# Altium schematic sheet TMS320C5509A.SchDoc
size 381 x 325 mm
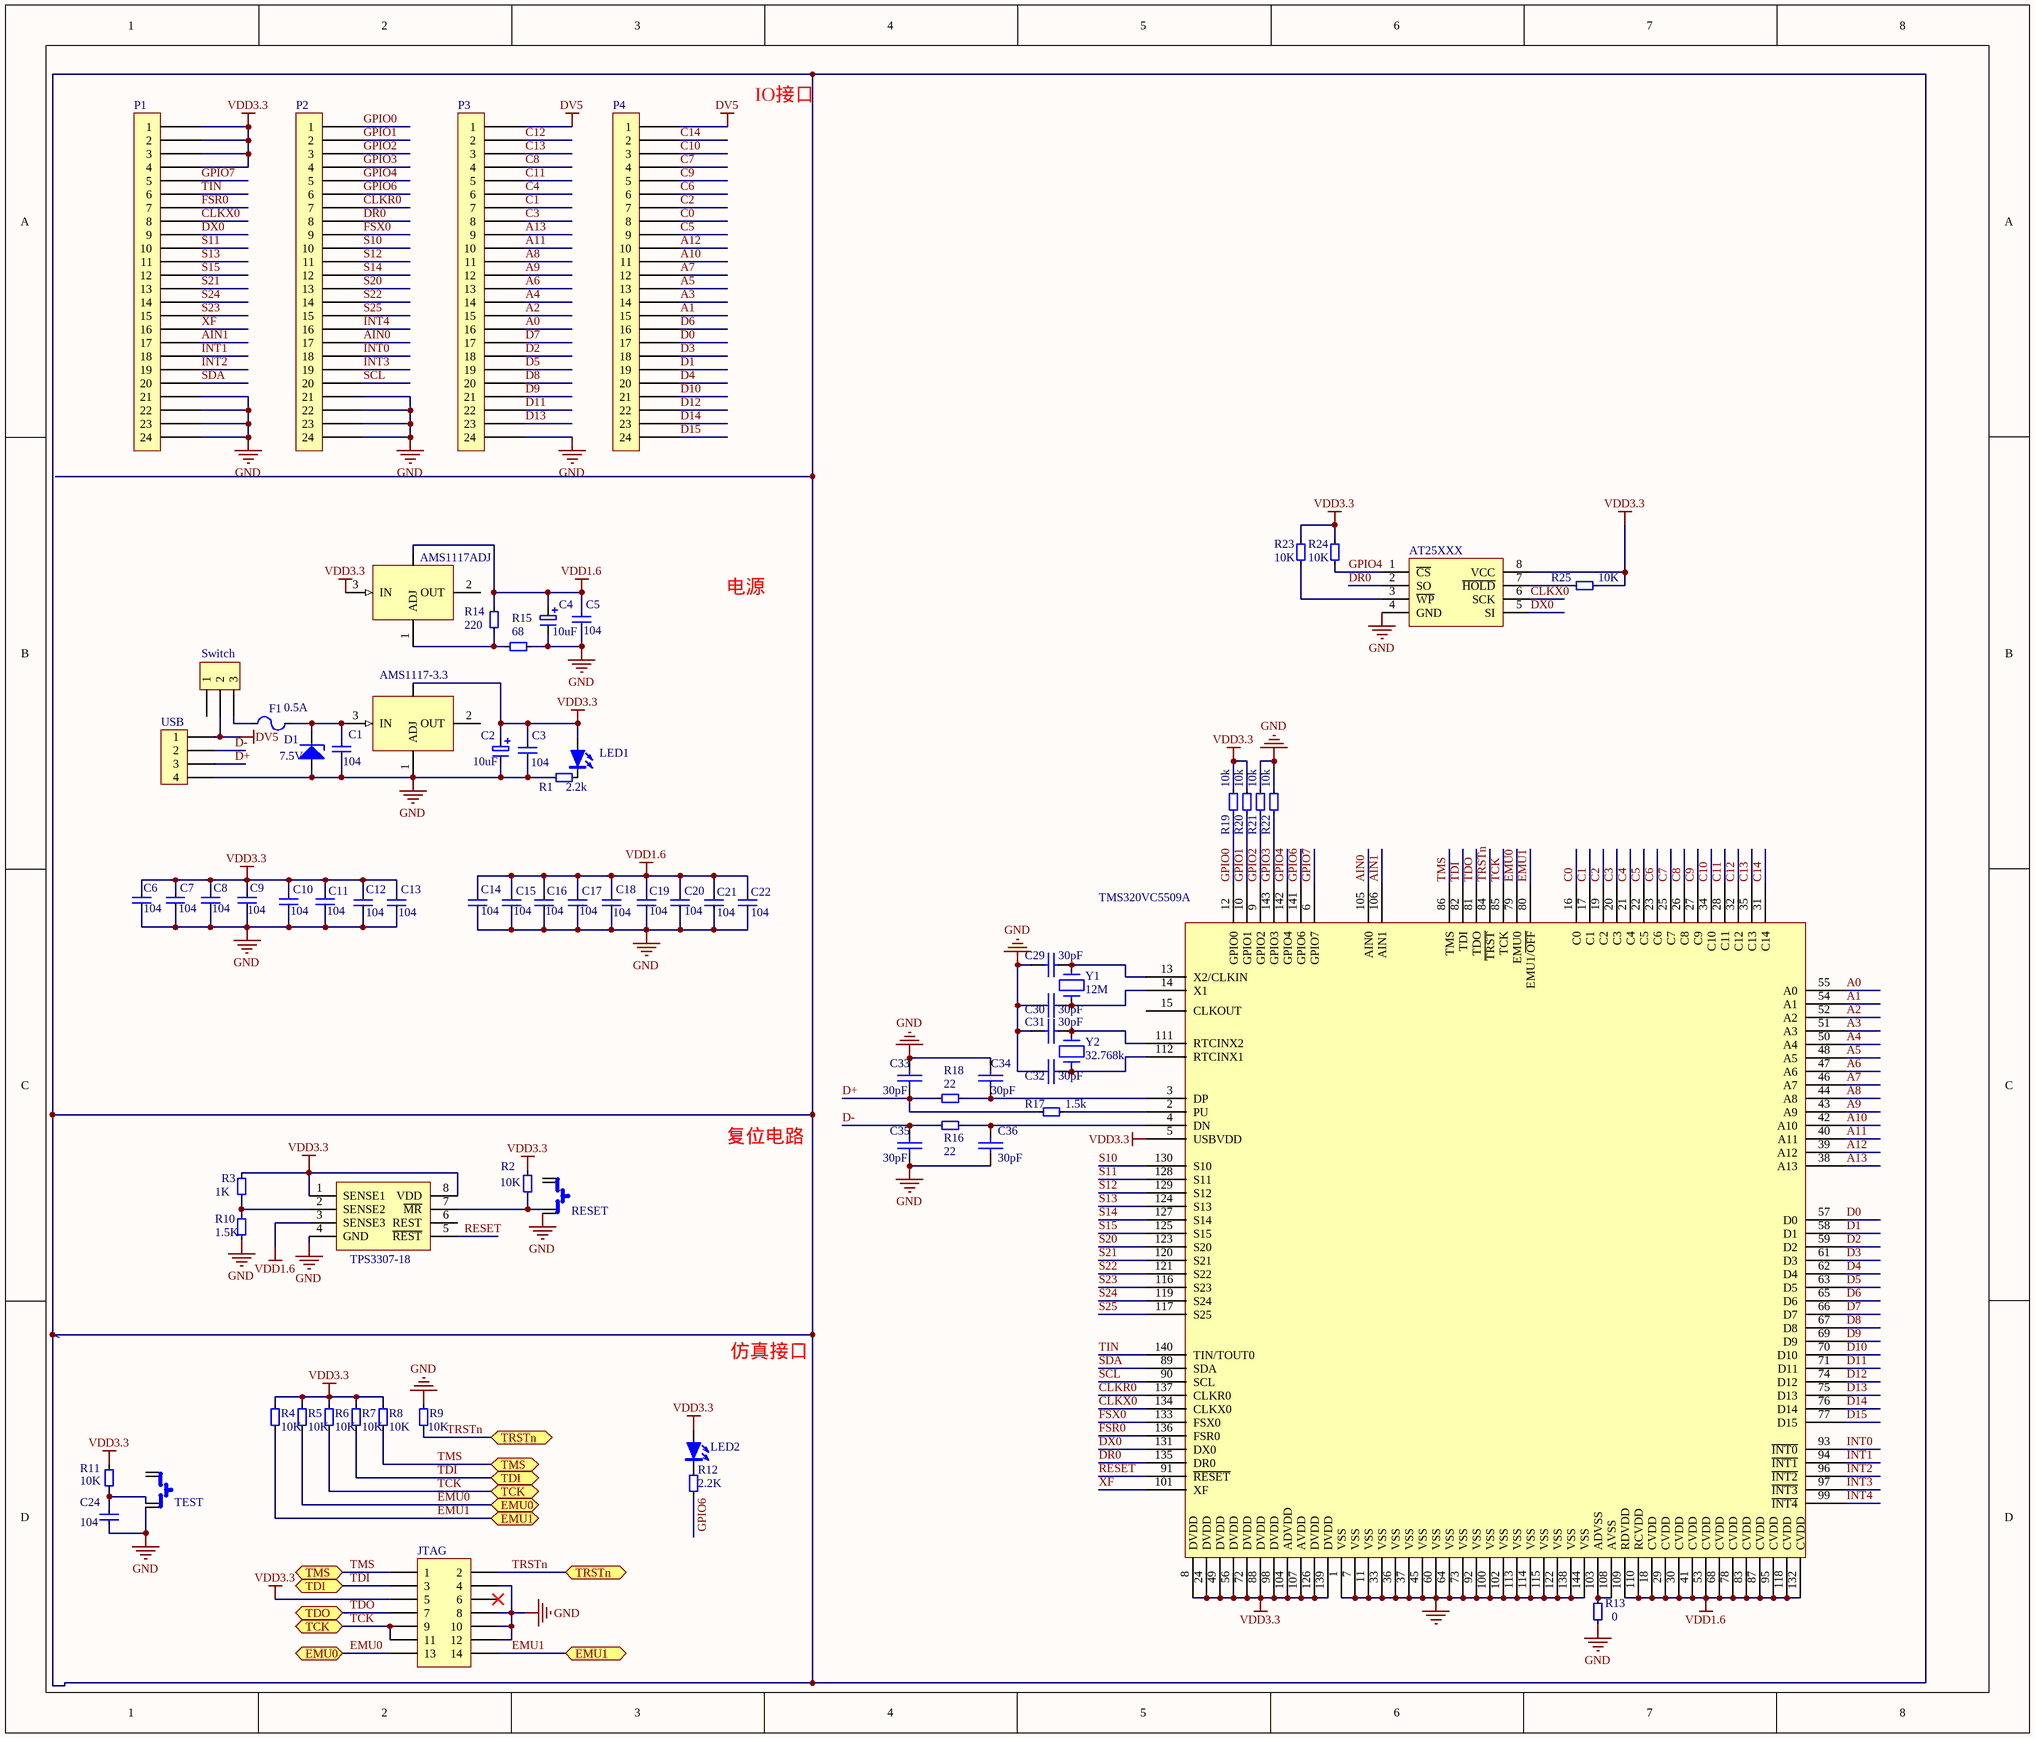
[diagram p0: TMS320C5509A.SchDoc]

## Parts
AMS1117-3.3  1117  [SOT-223]  (value not drawn)
AMS1117ADJ  1117  [SOT-223]  (value not drawn)
AT25XXX  (no value)
C1  104  [0805]
C2  10uF  [CE3528]
C3  104  [0805]
C4  10uF  [CE3528]
C5  104  [0805]
C6  104  [0805]
C7  104  [0805]
C8  104  [0805]
C9  104  [0805]
C10  104  [0805]
C11  104  [0805]
C12  104  [0805]
C13  104  [0805]
C14  104  [0805]
C15  104  [0805]
C16  104  [0805]
C17  104  [0805]
C18  104  [0805]
C19  104  [0805]
C20  104  [0805]
C21  104  [0805]
C22  104  [0805]
C24  104  [0805]
C29  30pF  [0805]
C30  30pF  [0805]
C31  30pF  [0805]
C32  30pF  [0805]
C33  30pF  [0805]
C34  30pF  [0805]
C35  30pF  [0805]
C36  30pF  [0805]
D1  7.5V  [1206]
F1  0.5A  [F4532]
JTAG  Header 7X2  [IDC14A]  (value not drawn)
LED1  LED2  [0805]  (value not drawn)
LED2  LED2  [0805]  (value not drawn)
P1  SIP24  [SIP24]  (value not drawn)
P2  SIP24  [SIP24]  (value not drawn)
P3  SIP24  [SIP24]  (value not drawn)
P4  SIP24  [SIP24]  (value not drawn)
R1  2.2k  [0805]
R2  10K  [0805]
R3  1K  [0805]
R4  10K  [0805]
R5  10K  [0805]
R6  10K  [0805]
R7  10K  [0805]
R8  10K  [0805]
R9  10K  [0805]
R10  1.5K  [0805]
R11  10K  [0805]
R12  2.2K  [0805]
R13  0  [0805]
R14  220  [0805]
R15  68  [0805]
R16  22  [0805]
R17  1.5k  [0805]
R18  22  [0805]
R19  10k  [0805]
R20  10k  [0805]
R21  10k  [0805]
R22  10k  [0805]
R23  10K  [0805]
R24  10K  [0805]
R25  10K  [0805]
RESET  KEY2  [KEY0.2']  (value not drawn)
Switch  CON3  [5脚船型开关]  (value not drawn)
TEST  KEY2  [KEY0.2']  (value not drawn)
TMS320VC5509A  TMS320VC5509A  [TMS320LV5410]  (value not drawn)
TPS3307-18  (no value)  [SOP8]
USB  CON4  [USB2]  (value not drawn)
Y1  12M  [CY1]
Y2  32.768k  [CY1]

## Ports
EMU0 (bidir), EMU1 (bidir), TCK (bidir), TDI (bidir), TDO, TMS (bidir), TRSTn (bidir)

## Nets
DV5: P3.1 P4.1 Switch.2 USB.1
GND: AMS1117-3.3.1(ADJ) AT25XXX.4(GND) C1.2 C2.2 C3.2 C4.2 C5.2 C6.2 C7.2 C8.2 C9.2 C10.2 C11.2 C12.2 C13.2 C14.2 C15.2 C16.2 C17.2 C18.2 C19.2 C20.2 C21.1 C22.1 C24.1 C29.1 C30.1 C31.1 C32.1 C33.1 C34.2 C35.1 C36.2 D1.1 JTAG.4 JTAG.8 JTAG.10 JTAG.12 P1.21 P1.22 P1.23 P1.24 P2.21 P2.22 P2.23 P2.24 P3.24 R1.2 R9.2 R10.2 R13.1 R15.2 R21.1 R22.1 RESET.3 TEST.3 TMS320VC5509A.1(VSS) TMS320VC5509A.7(VSS) TMS320VC5509A.11(VSS) TMS320VC5509A.33(VSS) TMS320VC5509A.36(VSS) TMS320VC5509A.37(VSS) TMS320VC5509A.45(VSS) TMS320VC5509A.60(VSS) TMS320VC5509A.64(VSS) TMS320VC5509A.73(VSS) TMS320VC5509A.92(VSS) TMS320VC5509A.100(VSS) TMS320VC5509A.102(VSS) TMS320VC5509A.113(VSS) TMS320VC5509A.114(VSS) TMS320VC5509A.115(VSS) TMS320VC5509A.122(VSS) TMS320VC5509A.138(VSS) TMS320VC5509A.144(VSS) TPS3307-18.4(GND) USB.4
VDD1.6: AMS1117ADJ.4 C4.1 C5.1 C14.1 C15.1 C16.1 C17.1 C18.1 C19.1 C20.1 C21.2 C22.2 R14.1 TMS320VC5509A.18(CVDD) TMS320VC5509A.29(CVDD) TMS320VC5509A.30(CVDD) TMS320VC5509A.41(CVDD) TMS320VC5509A.53(CVDD) TMS320VC5509A.68(CVDD) TMS320VC5509A.78(CVDD) TMS320VC5509A.83(CVDD) TMS320VC5509A.87(CVDD) TMS320VC5509A.95(CVDD) TMS320VC5509A.109(RDVDD) TMS320VC5509A.110(RCVDD) TMS320VC5509A.118(CVDD) TMS320VC5509A.132(CVDD) TPS3307-18.3(SENSE3)
VDD3.3: AMS1117-3.3.4 AMS1117ADJ.3(IN) AT25XXX.8(VCC) C2.1 C3.1 C6.1 C7.1 C8.1 C9.1 C10.1 C11.1 C12.1 C13.1 JTAG.5 LED1.1 LED2.1 P1.1 P1.2 P1.3 P1.4 R2.1 R3.2 R4.2 R5.2 R6.2 R7.2 R8.2 R11.1 R19.1 R20.1 R23.1 R24.2 R25.1 TMS320VC5509A.5(USBVDD) TMS320VC5509A.8(DVDD) TMS320VC5509A.24(DVDD) TMS320VC5509A.49(DVDD) TMS320VC5509A.56(DVDD) TMS320VC5509A.72(DVDD) TMS320VC5509A.88(DVDD) TMS320VC5509A.98(DVDD) TMS320VC5509A.104(ADVDD) TMS320VC5509A.107(AVDD) TMS320VC5509A.126(DVDD) TMS320VC5509A.139(DVDD) TPS3307-18.1(SENSE1) TPS3307-18.8(VDD)
A0: P3.16 TMS320VC5509A.55(A0)
A1: P4.15 TMS320VC5509A.54(A1)
A2: P3.15 TMS320VC5509A.52(A2)
A3: P4.14 TMS320VC5509A.51(A3)
A4: P3.14 TMS320VC5509A.50(A4)
A5: P4.13 TMS320VC5509A.48(A5)
A6: P3.13 TMS320VC5509A.47(A6)
A7: P4.12 TMS320VC5509A.46(A7)
A8: P3.11 TMS320VC5509A.44(A8)
A9: P3.12 TMS320VC5509A.43(A9)
A10: P4.11 TMS320VC5509A.42(A10)
A11: P3.10 TMS320VC5509A.40(A11)
A12: P4.10 TMS320VC5509A.39(A12)
A13: P3.9 TMS320VC5509A.38(A13)
AIN0: P2.17 TMS320VC5509A.105(AIN0)
AIN1: P1.17 TMS320VC5509A.106(AIN1)
C0: P4.8 TMS320VC5509A.16(C0)
C1: P3.7 TMS320VC5509A.17(C1)
C2: P4.7 TMS320VC5509A.19(C2)
C3: P3.8 TMS320VC5509A.20(C3)
C4: P3.6 TMS320VC5509A.21(C4)
C5: P4.9 TMS320VC5509A.22(C5)
C6: P4.6 TMS320VC5509A.23(C6)
C7: P4.4 TMS320VC5509A.25(C7)
C8: P3.4 TMS320VC5509A.26(C8)
C9: P4.5 TMS320VC5509A.27(C9)
C10: P4.3 TMS320VC5509A.34(C10)
C11: P3.5 TMS320VC5509A.28(C11)
C12: P3.2 TMS320VC5509A.32(C12)
C13: P3.3 TMS320VC5509A.35(C13)
C14: P4.2 TMS320VC5509A.31(C14)
CLKR0: P2.7 TMS320VC5509A.137(CLKR0)
CLKX0: AT25XXX.6(SCK) P1.8 TMS320VC5509A.134(CLKX0)
D0: P4.17 TMS320VC5509A.57(D0)
D1: P4.19 TMS320VC5509A.58(D1)
D2: P3.18 TMS320VC5509A.59(D2)
D3: P4.18 TMS320VC5509A.61(D3)
D4: P4.20 TMS320VC5509A.62(D4)
D5: P3.19 TMS320VC5509A.63(D5)
D6: P4.16 TMS320VC5509A.65(D6)
D7: P3.17 TMS320VC5509A.66(D7)
D8: P3.20 TMS320VC5509A.67(D8)
D9: P3.21 TMS320VC5509A.69(D9)
D10: P4.21 TMS320VC5509A.70(D10)
D11: P3.22 TMS320VC5509A.71(D11)
D12: P4.22 TMS320VC5509A.74(D12)
D13: P3.23 TMS320VC5509A.75(D13)
D14: P4.23 TMS320VC5509A.76(D14)
D15: P4.24 TMS320VC5509A.77(D15)
D+: C33.2 R17.2 R18.2 USB.3
D-: C35.2 R16.2 USB.2
DR0: AT25XXX.2(SO) P2.8 TMS320VC5509A.135(DR0)
DX0: AT25XXX.5(SI) P1.9 TMS320VC5509A.131(DX0)
EMU0: JTAG.13 R5.1 TMS320VC5509A.79(EMU0) ; port EMU0
EMU1: JTAG.14 R4.1 TMS320VC5509A.80(EMU1/~{OFF}) ; port EMU1
FSR0: P1.7 TMS320VC5509A.136(FSR0)
FSX0: P2.9 TMS320VC5509A.133(FSX0)
GPIO0: P2.1 R19.2 TMS320VC5509A.12(GPIO0)
GPIO1: P2.2 R20.2 TMS320VC5509A.10(GPIO1)
GPIO2: P2.3 R21.2 TMS320VC5509A.9(GPIO2)
GPIO3: P2.4 R22.2 TMS320VC5509A.143(GPIO3)
GPIO4: AT25XXX.1(~{CS}) P2.5 R24.1 TMS320VC5509A.142(GPIO4)
GPIO6: P2.6 R12.2 TMS320VC5509A.141(GPIO6)
GPIO7: P1.5 TMS320VC5509A.6(GPIO7)
INT0: P2.18 TMS320VC5509A.93(~{INT0})
INT1: P1.18 TMS320VC5509A.94(~{INT1})
INT2: P1.19 TMS320VC5509A.96(~{INT2})
INT3: P2.19 TMS320VC5509A.97(~{INT3})
INT4: P2.16 TMS320VC5509A.99(~{INT4})
RESET: TMS320VC5509A.91(~{RESET}) TPS3307-18.5(~{REST})
S10: P2.10 TMS320VC5509A.130(S10)
S11: P1.10 TMS320VC5509A.128(S11)
S12: P2.11 TMS320VC5509A.129(S12)
S13: P1.11 TMS320VC5509A.124(S13)
S14: P2.12 TMS320VC5509A.127(S14)
S15: P1.12 TMS320VC5509A.125(S15)
S20: P2.13 TMS320VC5509A.123(S20)
S21: P1.13 TMS320VC5509A.120(S21)
S22: P2.14 TMS320VC5509A.121(S22)
S23: P1.15 TMS320VC5509A.116(S23)
S24: P1.14 TMS320VC5509A.119(S24)
S25: P2.15 TMS320VC5509A.117(S25)
SCL: P2.20 TMS320VC5509A.90(SCL)
SDA: P1.20 TMS320VC5509A.89(SDA)
TCK: JTAG.9 JTAG.11 R6.1 TMS320VC5509A.85(TCK) ; port TCK
TDI: JTAG.3 R7.1 TMS320VC5509A.82(TDI) ; port TDI
TDO: JTAG.7 TMS320VC5509A.81(TDO) ; port TDO
TIN: P1.6 TMS320VC5509A.140(TIN/TOUT0)
TMS: JTAG.1 R8.1 TMS320VC5509A.86(TMS) ; port TMS
TRSTn: JTAG.2 R9.1 TMS320VC5509A.84(~{TRST}) ; port TRSTn
XF: P1.16 TMS320VC5509A.101(XF)
NetAMS1117-3.3_3: AMS1117-3.3.3(IN) C1.1 D1.2 F1.2
NetAMS1117ADJ_1: AMS1117ADJ.1(ADJ) R14.2 R15.1
NetAT25XXX_3: AT25XXX.3(~{WP}) R23.2
NetAT25XXX_7: AT25XXX.7(~{HOLD}) R25.2
NetC24_2: C24.2 R11.2 TEST.4
NetC29_2: C29.2 TMS320VC5509A.13(X2/CLKIN) Y1.2
NetC30_2: C30.2 TMS320VC5509A.14(X1) Y1.1
NetC31_2: C31.2 TMS320VC5509A.111(RTCINX2) Y2.1
NetC32_2: C32.2 TMS320VC5509A.112(RTCINX1) Y2.2
NetC34_1: C34.1 R18.1 TMS320VC5509A.3(DP)
NetC36_1: C36.1 R16.1 TMS320VC5509A.4(DN)
NetF1_1: F1.1 Switch.3
NetLED1_2: LED1.2 R1.1
NetLED2_2: LED2.2 R12.1
NetR2_2: R2.2 RESET.4 TPS3307-18.7(~{MR})
NetR3_1: R3.1 R10.1 TPS3307-18.2(SENSE2)
NetR13_2: R13.2 TMS320VC5509A.103(ADVSS) TMS320VC5509A.108(AVSS)
NetR17_1: R17.1 TMS320VC5509A.2(PU)

Not connected (* = marked no-connect by the designer): AMS1117-3.3 2(OUT); AMS1117ADJ 2(OUT); JTAG 6*; RESET 1 2; Switch 1; TEST 1 2; TMS320VC5509A 15(CLKOUT); TPS3307-18 6(REST)

## Notes on the sheet
- IO接口
- 电源
- 复位电路
- 仿真接口

## Library data of the parts
AT25XXX = AT25XXX
C1 C3 C5-C22 C24 = C3
C2 C4 = E3
C29-C36 = C1: 0.1: *; 0.01: *; 0.47: *; 0.22: *; 0.022: *; 2.2n: *; 1n: *
D1 = D4
F1 = FUSE1
JTAG = Header 7X2: Header, 7-Pin, Dual row; Revision: 17-Jul-2002: Re-released for DXP Platform.; Publisher: Altium Limited
R1-R25 = R3
TMS320VC5509A = TMS320VC5509A: TMS320VC5509
TPS3307-18 = TPS3307-18
Y1 Y2 = CY1